# Altium schematic sheet V_4.SchDoc
size A4
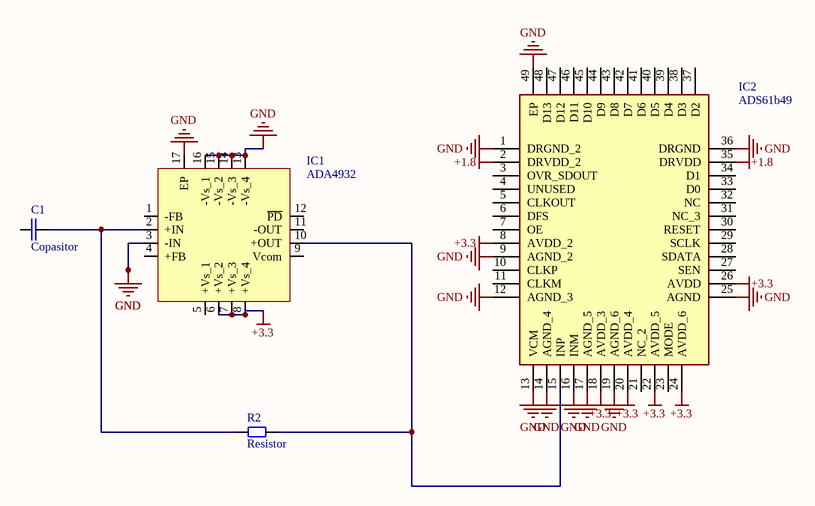
[diagram p0: V_4.SchDoc]

## Parts
C1  Copasitor  [Copasitor]
IC1  ADA4932  [ADA4932]
IC2  ADS61b49  [ADS61b49]
R2  Resistor  [Resistor]

## Nets
+1.8: IC2.2(DRVDD_2) IC2.35(DRVDD)
+3.3: IC1.6(+Vs_2) IC1.7(+Vs_3) IC1.8(+Vs_4) IC2.8(AVDD_2) IC2.18(AVDD_3) IC2.20(AVDD_4) IC2.22(AVDD_5) IC2.24(AVDD_6) IC2.26(AVDD)
GND: IC1.3(-IN) IC1.13(-Vs_4) IC1.14(-Vs_3) IC1.15(-Vs_2) IC1.16(-Vs_1) IC1.17(EP) IC2.1(DRGND_2) IC2.9(AGND_2) IC2.12(AGND_3) IC2.13(VCM) IC2.14(AGND_4) IC2.16(INM) IC2.17(AGND_5) IC2.19(AGND_6) IC2.25(AGND) IC2.36(DRGND) IC2.49(EP)
NetC1_2: C1.2 IC1.2(+IN) R2.1
NetIC1_10: IC1.10(+OUT) IC2.15(INP) R2.2

Not connected (* = marked no-connect by the designer): C1 1; IC1 1(-FB) 4(+FB) 5(+Vs_1) 9(Vcom) 11(-OUT) 12(~{PD}); IC2 3(OVR_SDOUT) 4(UNUSED) 5(CLKOUT) 6(DFS) 7(OE) 10(CLKP) 11(CLKM) 21(NC_2) 23(MODE) 27(SEN) 28(SDATA) 29(SCLK) 30(RESET) 31(NC_3) 32(NC) 33(D0) 34(D1) 37(D2) 38(D3) 39(D4) 40(D5) 41(D6) 42(D7) 43(D8) 44(D9) 45(D10) 46(D11) 47(D12) 48(D13)